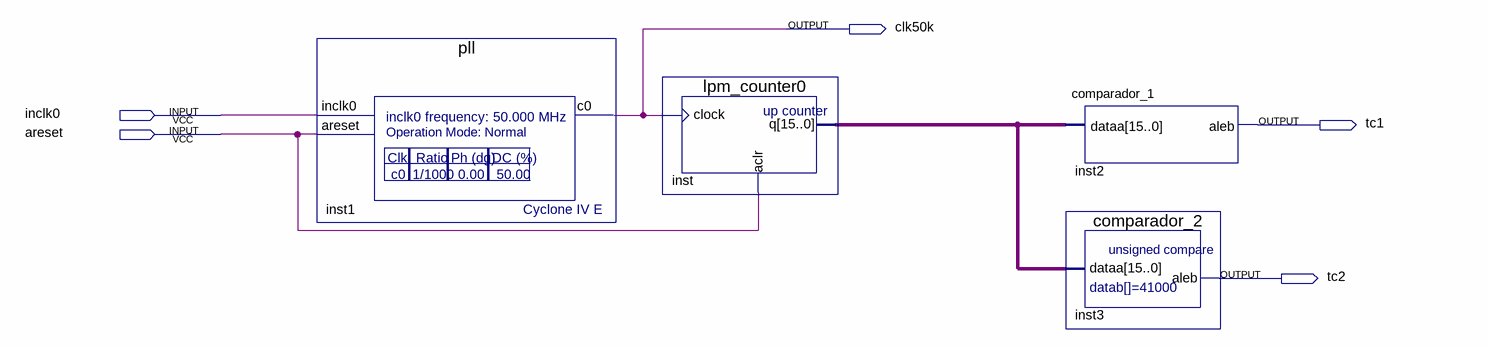
[diagram p0: schematic sheet]
// Quartus schematic contador_doblar.bdf as structural Verilog: 4 symbols, 5 pins
module contador_doblar (
  input  inclk0,
  input  areset,
  output clk50k,
  output tc1,
  output tc2
);

  wire [15:0] inst_q;

  pll inst1 (.inclk0(inclk0), .areset(areset), .c0(clk50k));
  lpm_counter0 inst (.clock(clk50k), .aclr(areset), .q(inst_q));
  comparador_1 inst2 (.dataa(inst_q), .aleb(tc1));
  comparador_2 inst3 (.dataa(inst_q), .aleb(tc2));
endmodule
